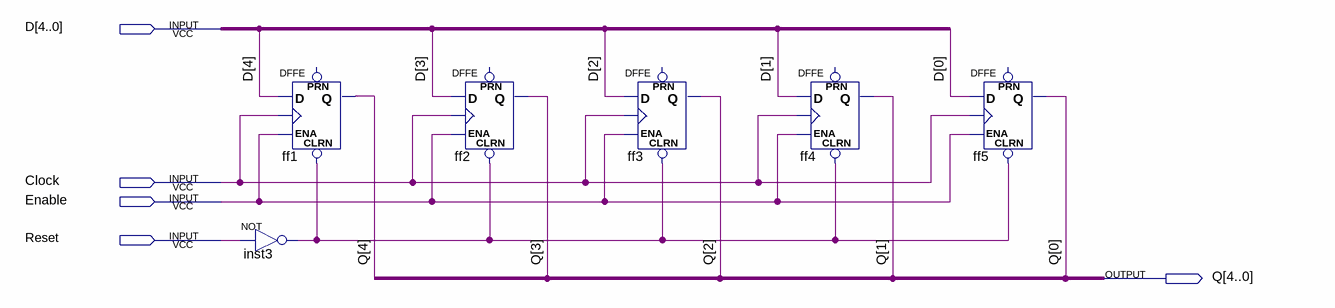
[diagram p0: schematic sheet]
// Quartus schematic register5.bdf as structural Verilog: 6 symbols, 5 pins
module register5 (
  input  [4:0] D,
  input  Clock,
  input  Enable,
  input  Reset,
  output [4:0] Q
);

  wire inst3_out;

  DFFE ff1 (.CLRN(inst3_out), .D(D[4]), .CLK(Clock), .ENA(Enable), .Q(Q[4]));  // open: PRN
  not inst3 (inst3_out, Reset);
  DFFE ff2 (.CLRN(inst3_out), .D(D[3]), .CLK(Clock), .ENA(Enable), .Q(Q[3]));  // open: PRN
  DFFE ff3 (.CLRN(inst3_out), .D(D[2]), .CLK(Clock), .ENA(Enable), .Q(Q[2]));  // open: PRN
  DFFE ff4 (.CLRN(inst3_out), .D(D[1]), .CLK(Clock), .ENA(Enable), .Q(Q[1]));  // open: PRN
  DFFE ff5 (.CLRN(inst3_out), .D(D[0]), .CLK(Clock), .ENA(Enable), .Q(Q[0]));  // open: PRN
endmodule
